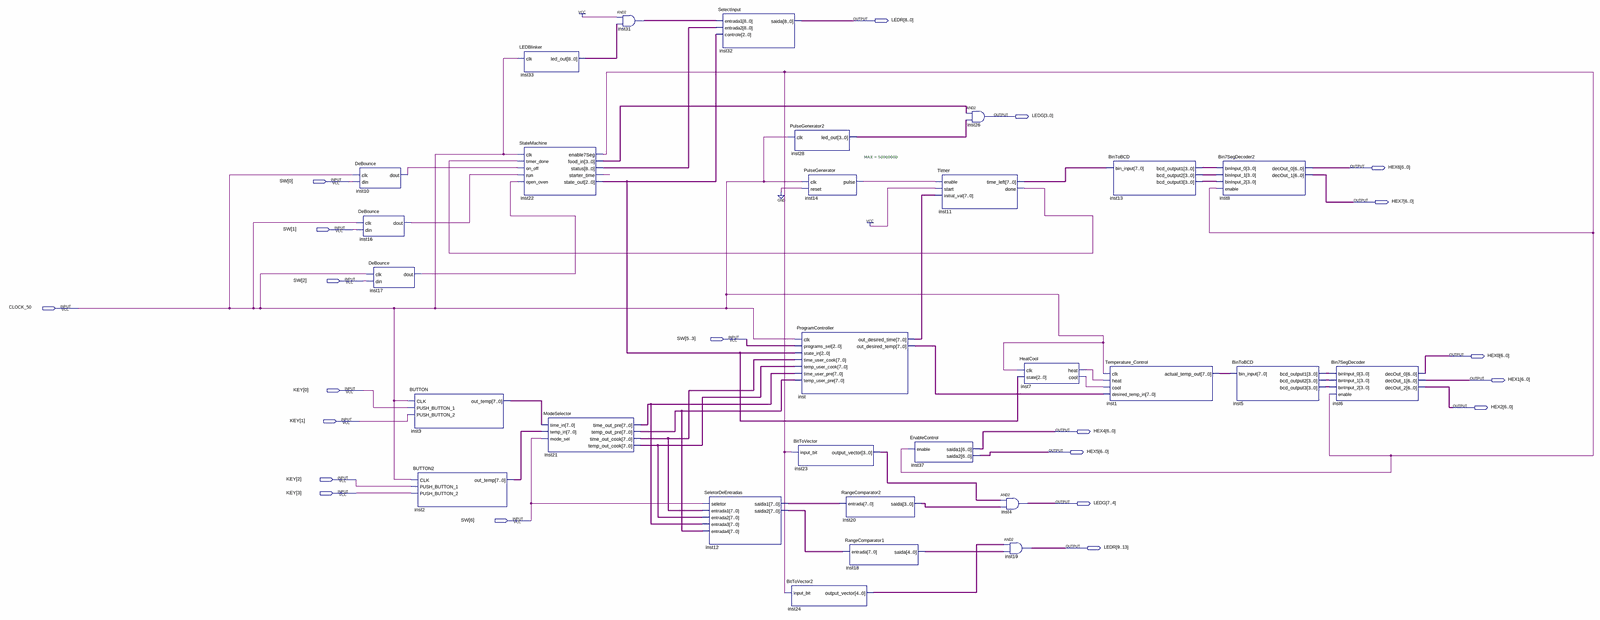
[diagram p0: schematic sheet, whole]
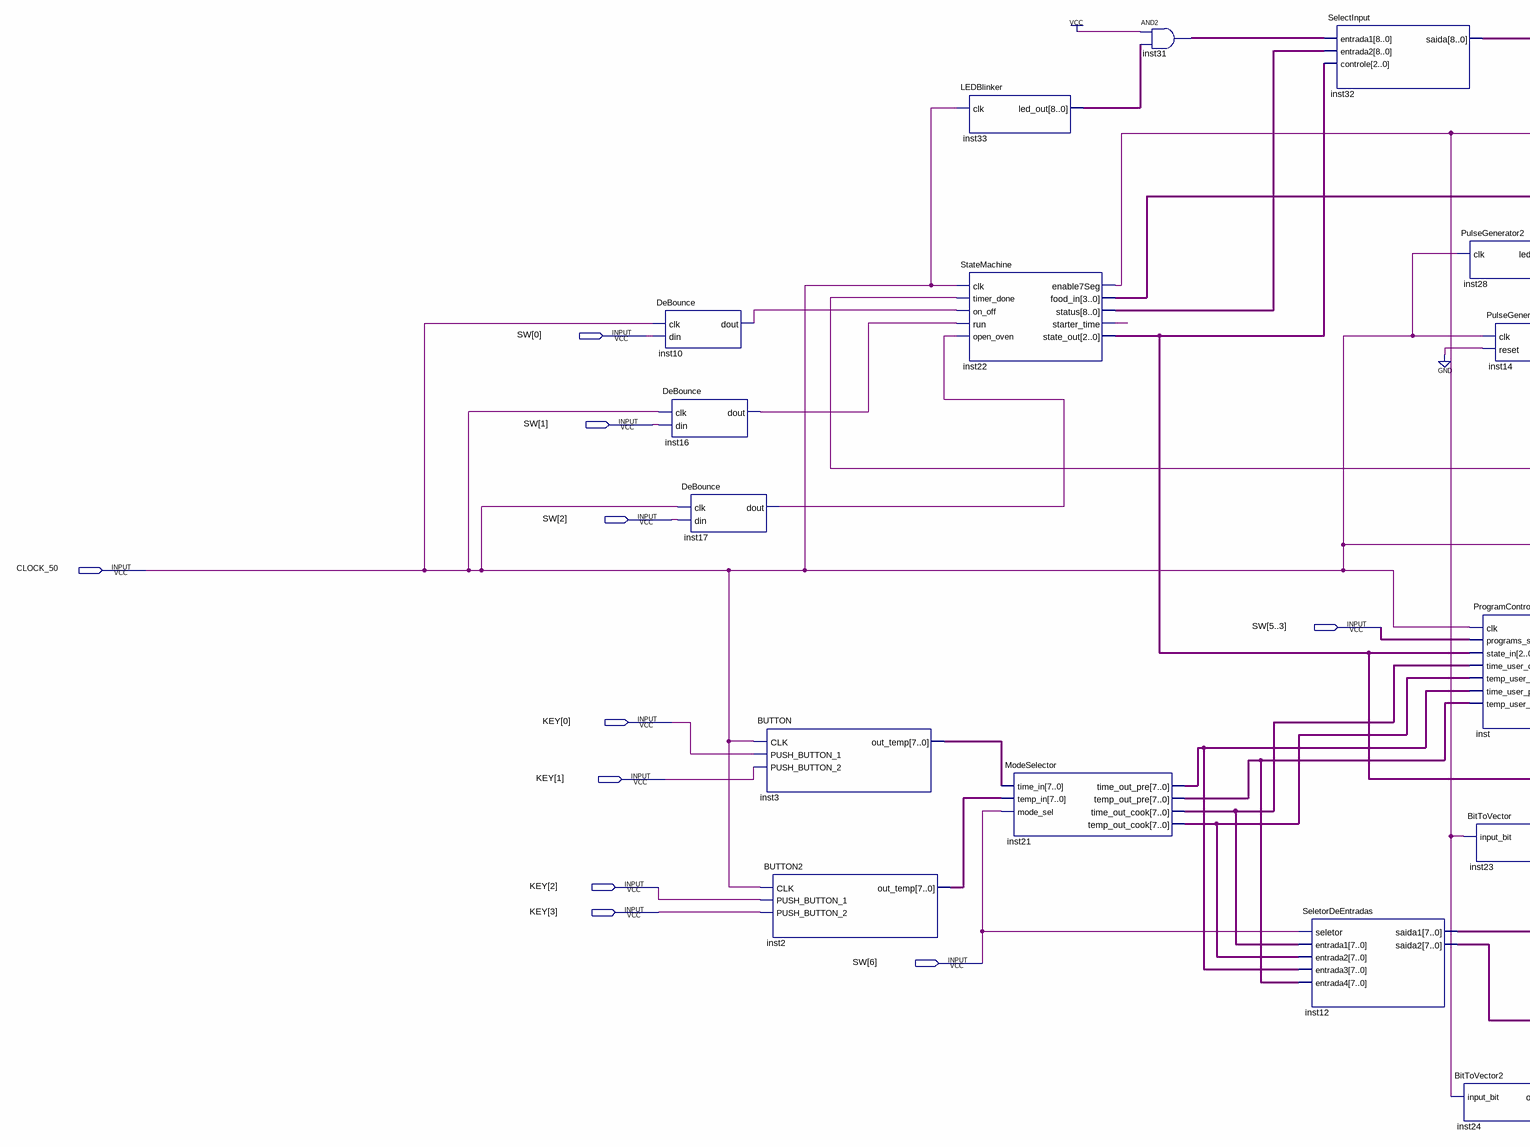
[diagram p1: schematic sheet, left part]
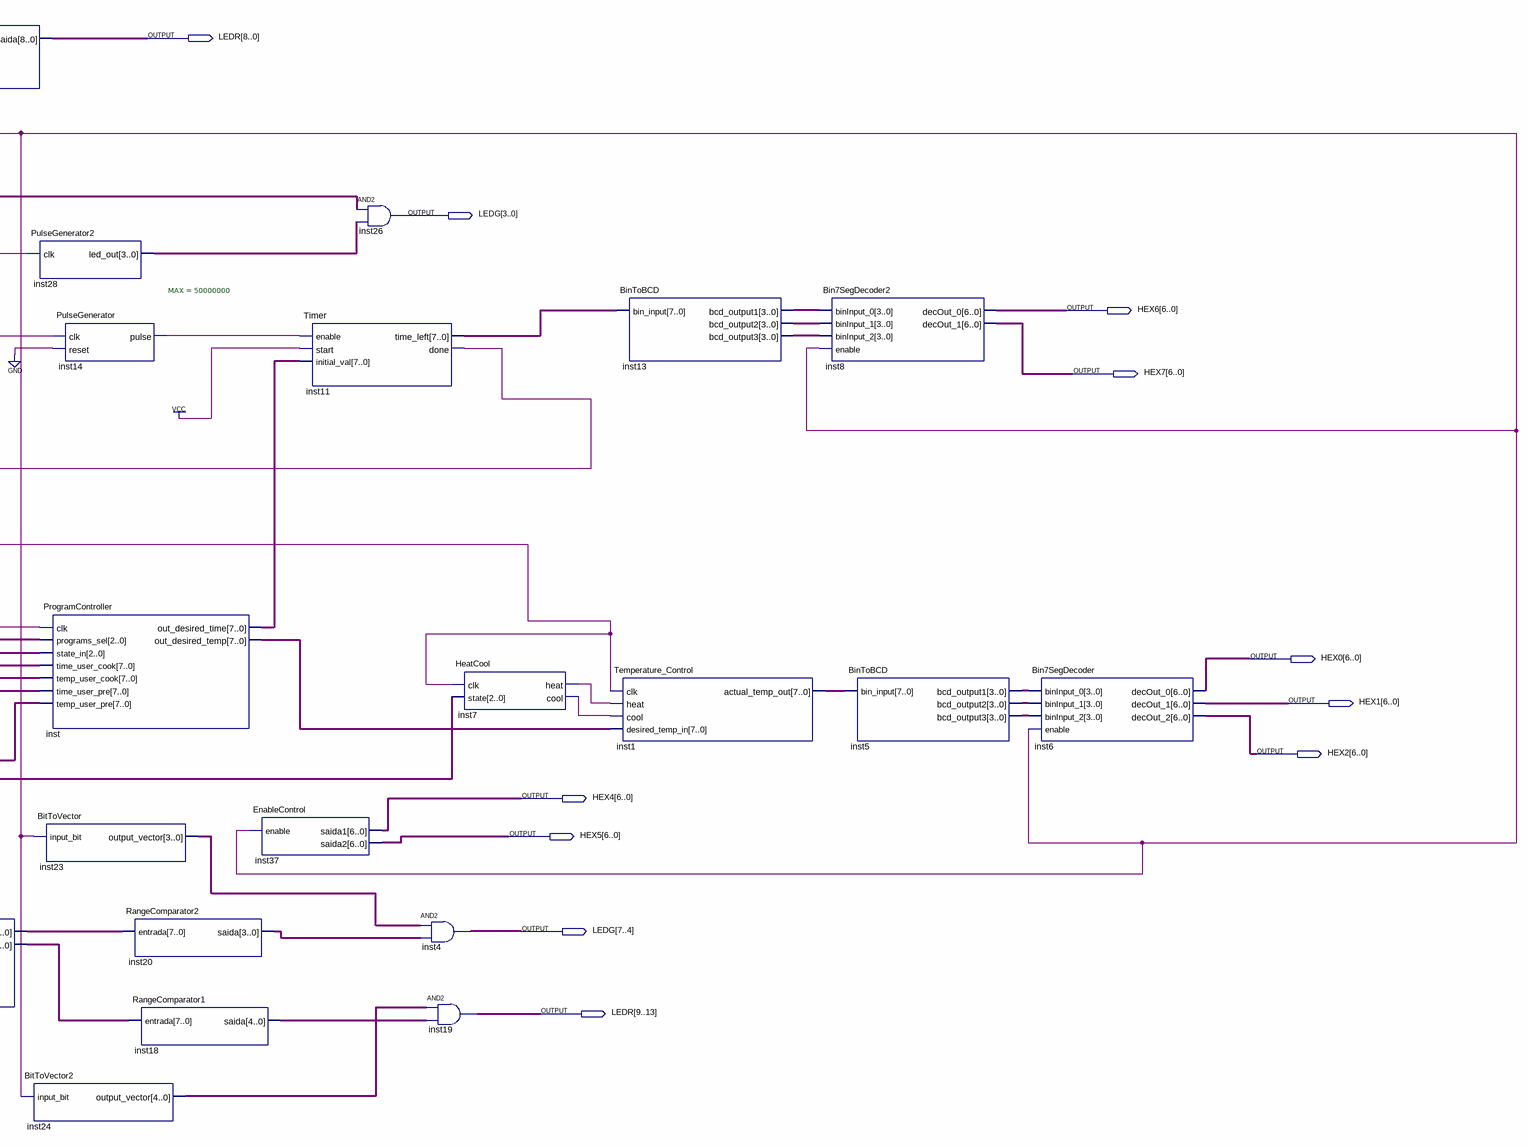
[diagram p2: schematic sheet, right part]
// Quartus schematic ProgramControler_Demo.bdf as structural Verilog: 29 symbols, 21 pins
module ProgramControler_Demo (
  input  [6:0] SW,
  input  CLOCK_50,
  input  [3:0] KEY,
  output [0:13] LEDR,
  output [7:0] LEDG,
  output [6:0] HEX6,
  output [6:0] HEX7,
  output [6:0] HEX0,
  output [6:0] HEX1,
  output [6:0] HEX2,
  output [6:0] HEX4,
  output [6:0] HEX5
);

  wire inst7_cool, inst7_heat, inst10_dout, inst11_done, inst14_pulse, inst16_dout, inst17_dout,
       inst22_enable7seg, inst22_starter_time;
  wire [2:0] inst22_state_out;
  wire [3:0] inst5_bcd_output1, inst5_bcd_output2, inst5_bcd_output3, inst13_bcd_output1, inst13_bcd_output2,
       inst13_bcd_output3, inst20_saida, inst22_food_in, inst23_output_vector, inst28_led_out;
  wire [4:0] inst18_saida, inst24_output_vector;
  wire [7:0] inst1_actual_temp_out, inst2_out_temp, inst3_out_temp, inst11_time_left, inst12_saida1,
       inst12_saida2, inst21_temp_out_cook, inst21_temp_out_pre, inst21_time_out_cook, inst21_time_out_pre,
       inst_out_desired_temp, inst_out_desired_time;
  wire [8:0] inst22_status, inst31_out, inst33_led_out;

  DeBounce inst10 (.clk(CLOCK_50), .din(SW[0]), .dout(inst10_dout));
  DeBounce inst16 (.clk(CLOCK_50), .din(SW[1]), .dout(inst16_dout));
  DeBounce inst17 (.clk(CLOCK_50), .din(SW[2]), .dout(inst17_dout));
  BUTTON inst3 (.CLK(CLOCK_50), .PUSH_BUTTON_1(KEY[0]), .PUSH_BUTTON_2(KEY[1]), .out_temp(inst3_out_temp));
  BUTTON2 inst2 (.CLK(CLOCK_50), .PUSH_BUTTON_1(KEY[2]), .PUSH_BUTTON_2(KEY[3]), .out_temp(inst2_out_temp));
  LEDBlinker inst33 (.clk(CLOCK_50), .led_out(inst33_led_out));
  StateMachine inst22 (
    .clk(CLOCK_50), .timer_done(inst11_done), .on_off(inst10_dout), .run(inst16_dout),
    .open_oven(inst17_dout), .enable7Seg(inst22_enable7seg), .food_in(inst22_food_in),
    .status(inst22_status), .starter_time(inst22_starter_time), .state_out(inst22_state_out));
  ModeSelector inst21 (
    .time_in(inst3_out_temp), .temp_in(inst2_out_temp), .mode_sel(SW[6]), .time_out_pre(inst21_time_out_pre),
    .temp_out_pre(inst21_temp_out_pre), .time_out_cook(inst21_time_out_cook),
    .temp_out_cook(inst21_temp_out_cook));
  assign inst31_out = {9{1'b1}} & inst33_led_out;  // AND2 inst31, 9 bits wide
  SeletorDeEntradas inst12 (
    .seletor(SW[6]), .entrada1(inst21_time_out_cook), .entrada2(inst21_temp_out_cook),
    .entrada3(inst21_time_out_pre), .entrada4(inst21_temp_out_pre), .saida1(inst12_saida1),
    .saida2(inst12_saida2));
  SelectInput inst32 (
    .entrada1(inst31_out), .entrada2(inst22_status), .controle(inst22_state_out),
    .saida({LEDR[8], LEDR[7], LEDR[6], LEDR[5], LEDR[4], LEDR[3], LEDR[2], LEDR[1], LEDR[0]}));
  PulseGenerator2 inst28 (.clk(CLOCK_50), .led_out(inst28_led_out));
  BitToVector inst23 (.input_bit(inst22_enable7seg), .output_vector(inst23_output_vector));
  BitToVector2 inst24 (.input_bit(inst22_enable7seg), .output_vector(inst24_output_vector));
  PulseGenerator #(.MAX(50000000)) inst14 (.clk(CLOCK_50), .reset(1'b0), .pulse(inst14_pulse));
  ProgramController inst (
    .clk(CLOCK_50), .programs_sel(SW[5:3]), .state_in(inst22_state_out),
    .time_user_cook(inst21_time_out_cook), .temp_user_cook(inst21_temp_out_cook),
    .time_user_pre(inst21_time_out_pre), .temp_user_pre(inst21_temp_out_pre),
    .out_desired_time(inst_out_desired_time), .out_desired_temp(inst_out_desired_temp));
  RangeComparator2 inst20 (.entrada(inst12_saida1), .saida(inst20_saida));
  RangeComparator1 inst18 (.entrada(inst12_saida2), .saida(inst18_saida));
  EnableControl inst37 (.enable(inst22_enable7seg), .saida1(HEX4), .saida2(HEX5));
  Timer inst11 (
    .enable(inst14_pulse), .start(1'b1), .initial_val(inst_out_desired_time), .time_left(inst11_time_left),
    .done(inst11_done));
  assign LEDG[3:0] = inst22_food_in & inst28_led_out;  // AND2 inst26, 4 bits wide
  assign LEDG[7:4] = inst23_output_vector & inst20_saida;  // AND2 inst4, 4 bits wide
  assign LEDR[9:13] = inst24_output_vector & inst18_saida;  // AND2 inst19, 5 bits wide
  HeatCool inst7 (.clk(CLOCK_50), .state(inst22_state_out), .heat(inst7_heat), .cool(inst7_cool));
  BinToBCD inst13 (
    .bin_input(inst11_time_left), .bcd_output1(inst13_bcd_output1), .bcd_output2(inst13_bcd_output2),
    .bcd_output3(inst13_bcd_output3));
  Temperature_Control inst1 (
    .clk(CLOCK_50), .heat(inst7_heat), .cool(inst7_cool), .desired_temp_in(inst_out_desired_temp),
    .actual_temp_out(inst1_actual_temp_out));
  Bin7SegDecoder2 inst8 (
    .binInput_0(inst13_bcd_output1), .binInput_1(inst13_bcd_output2), .binInput_2(inst13_bcd_output3),
    .enable(inst22_enable7seg), .decOut_0(HEX6), .decOut_1(HEX7));
  BinToBCD inst5 (
    .bin_input(inst1_actual_temp_out), .bcd_output1(inst5_bcd_output1), .bcd_output2(inst5_bcd_output2),
    .bcd_output3(inst5_bcd_output3));
  Bin7SegDecoder inst6 (
    .binInput_0(inst5_bcd_output1), .binInput_1(inst5_bcd_output2), .binInput_2(inst5_bcd_output3),
    .enable(inst22_enable7seg), .decOut_0(HEX0), .decOut_1(HEX1), .decOut_2(HEX2));
endmodule
